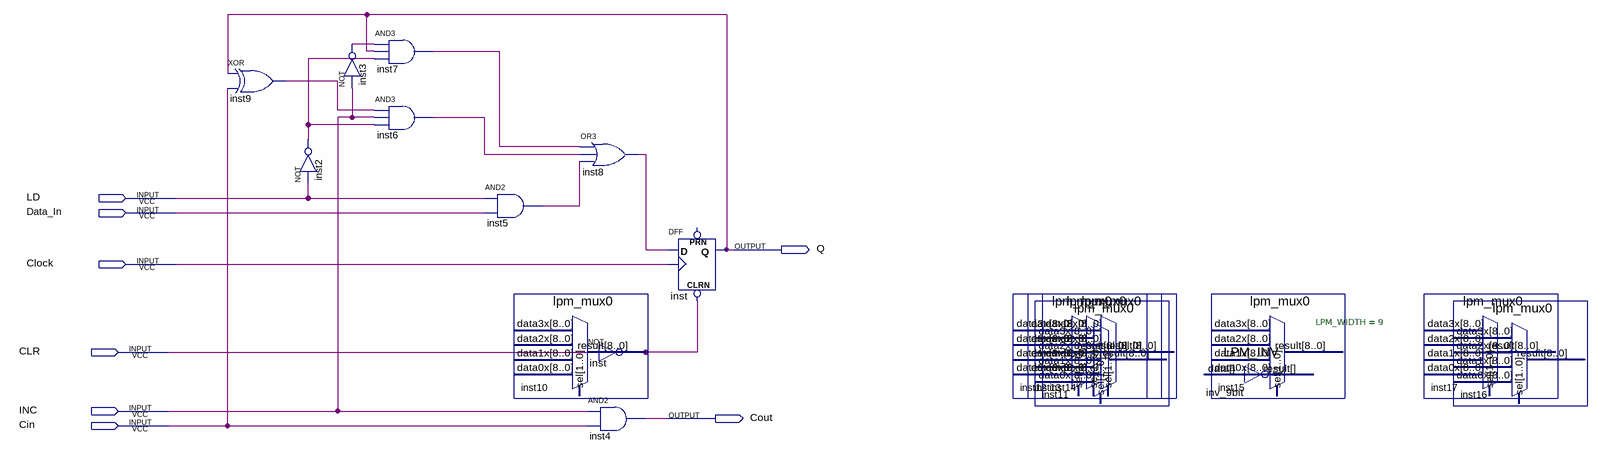
[diagram p0: schematic sheet]
// Quartus schematic Bit_hucresi.bdf as structural Verilog: 19 symbols, 8 pins
module Bit_hucresi (
  input  LD,
  input  Data_In,
  input  Clock,
  input  CLR,
  input  INC,
  input  Cin,
  output Q,
  output Cout
);

  wire inst2_out, inst3_out, inst5_out, inst6_out, inst7_out, inst8_out, inst9_out, inst10_result;

  xor inst9 (inst9_out, Q, Cin);
  not inst2 (inst2_out, LD);
  and inst7 (inst7_out, inst3_out, Q, inst2_out);
  not inst3 (inst3_out, INC);
  and inst6 (inst6_out, inst9_out, INC, inst2_out);
  and inst5 (inst5_out, LD, Data_In);
  lpm_mux0 inst10 (.result(inst10_result));  // open: data3x, data2x, data1x, data0x, sel
  or inst8 (inst8_out, inst7_out, inst6_out, inst5_out);
  not inst (inst10_result, CLR);
  and inst4 (Cout, INC, Cin);
  DFF inst_dup2 (.CLRN(inst10_result), .CLK(Clock), .D(inst8_out), .Q(Q));  // open: PRN
  lpm_mux0 inst12 ();  // open: data3x, data2x, data1x, data0x, sel, result
  lpm_mux0 inst13 ();  // open: data3x, data2x, data1x, data0x, sel, result
  lpm_mux0 inst14 ();  // open: data3x, data2x, data1x, data0x, sel, result
  lpm_mux0 inst11 ();  // open: data3x, data2x, data1x, data0x, sel, result
  lpm_mux0 inst15 ();  // open: data3x, data2x, data1x, data0x, sel, result
  LPM_INV #(.LPM_WIDTH(9)) inv_9bit ();  // open: data, result
  lpm_mux0 inst17 ();  // open: data3x, data2x, data1x, data0x, sel, result
  lpm_mux0 inst16 ();  // open: data3x, data2x, data1x, data0x, sel, result
endmodule
